# EAGLE design zzh-debug (EAGLE 9.5.2)
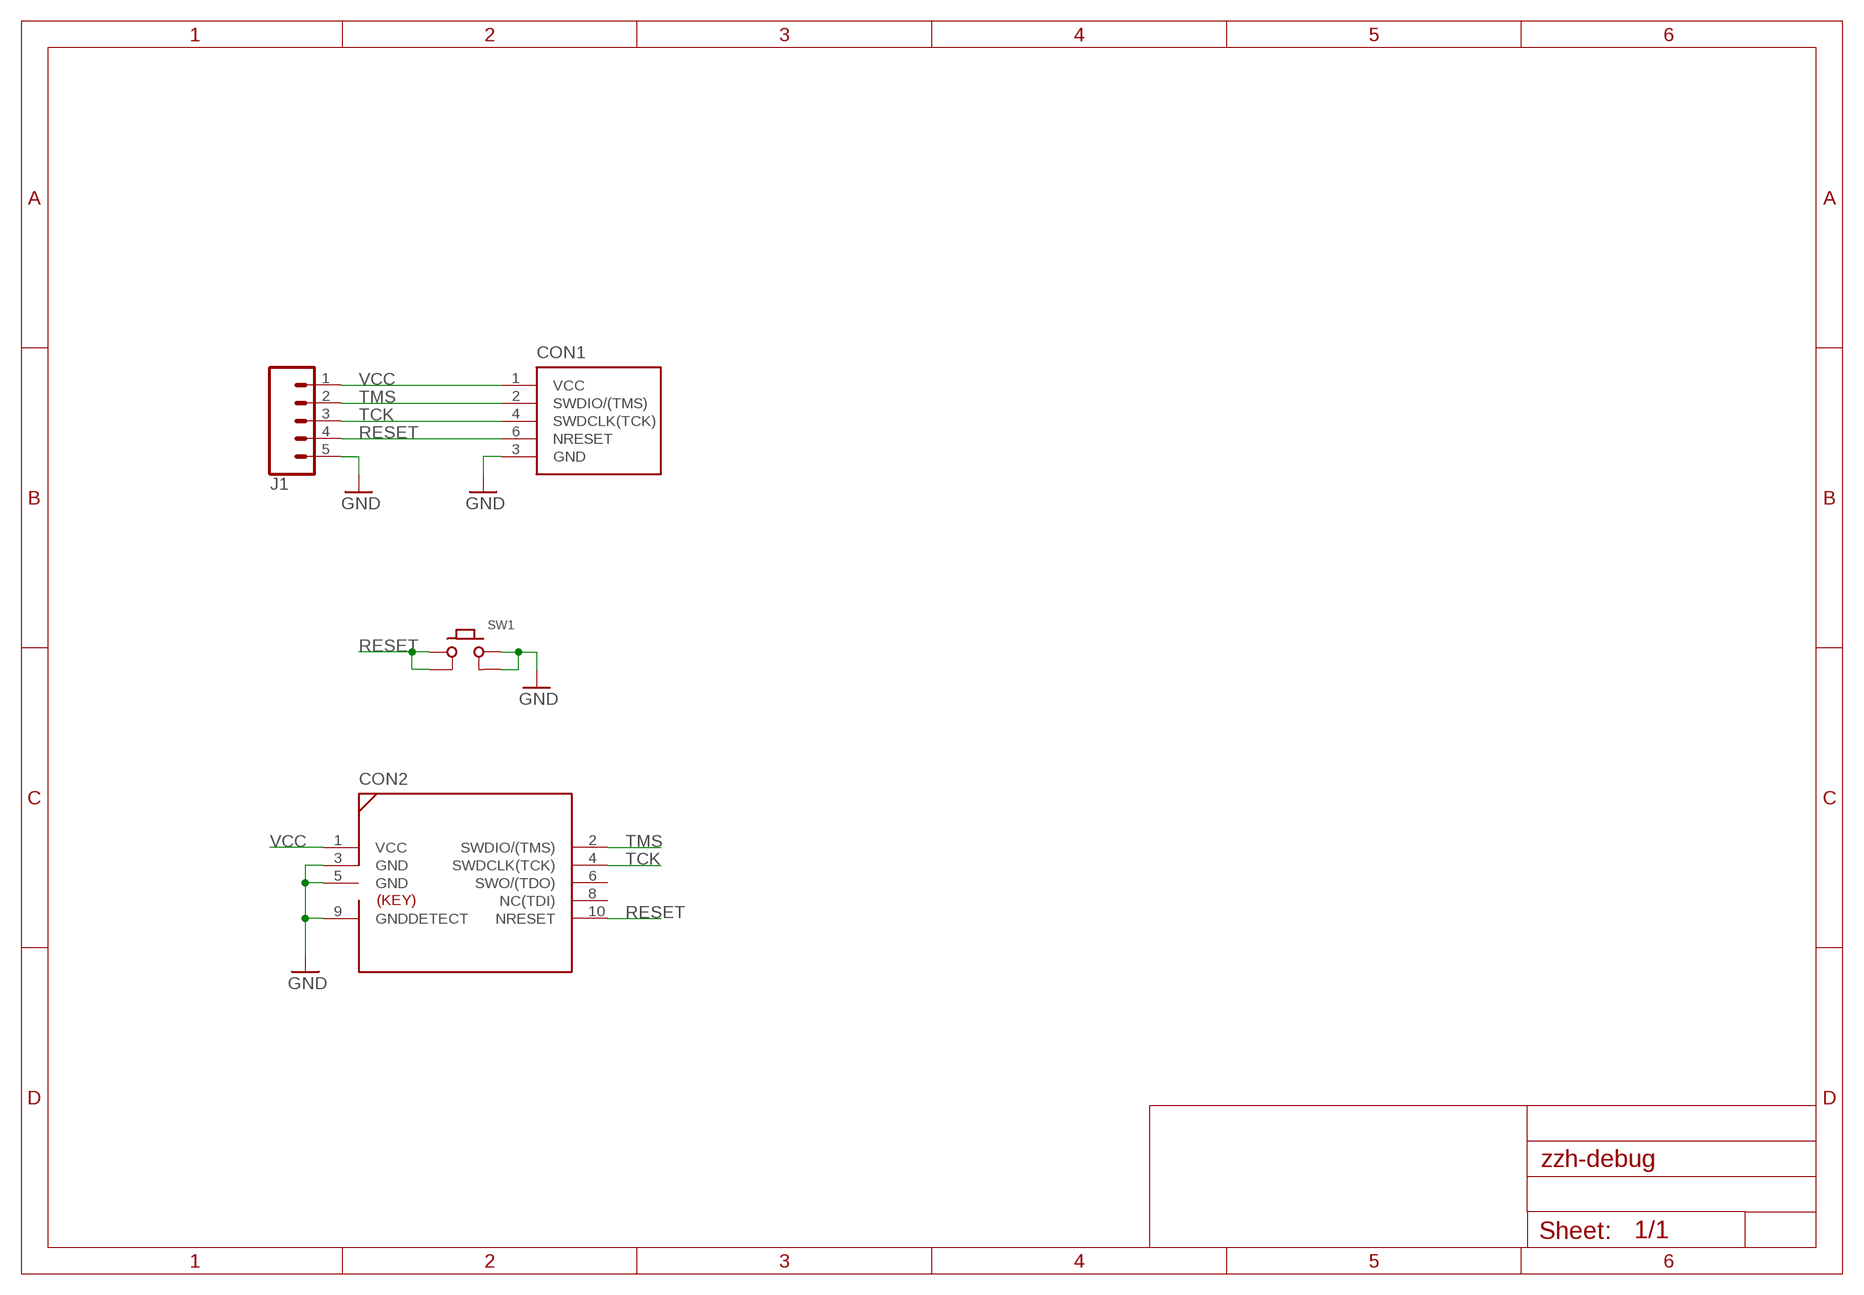
[diagram p0: schematic, sheet 1]

## Parts
CON1  DEBUG_CORTEX-SWD-5PIN-FEMALE6  [SHENZHEN_2X3_1.27MM_TH_FEMALE]
CON2  DEBUG_CORTEX-SWD-TH  [SHENZHEN_2X5_1.27MM_TH_MALE_SHROUD]
J1  CONN_05LOCK_LONGPADS  [1X05_LOCK_LONGPADS]
SW1  PUSHBUTTON-K2-1177SW-D4DW-06  [K2-1177SW-D4DW-06]

## Nets
GND: CON1.3(GND) CON2.3(GND) CON2.5(GND) CON2.9(GNDDETECT) J1.5 SW1.3(2_1) SW1.4(2_2)
RESET: CON1.6(NRESET) CON2.10(NRESET) J1.4 SW1.1(1_1) SW1.2(1_2)
TCK: CON1.4(SWDCLK(TCK)) CON2.4(SWDCLK(TCK)) J1.3
TMS: CON1.2(SWDIO/(TMS)) CON2.2(SWDIO/(TMS)) J1.2
VCC: CON1.1(VCC) CON2.1(VCC) J1.1
Unconnected: CON2.6(SWO/(TDO)) CON2.8(NC(TDI))

## Library data of the parts
CON1 = ok-testdebug-dev:DEBUG_CORTEX-SWD-5PIN
CON2 = ok-testdebug-dev:DEBUG_CORTEX-SWD
J1 = SparkFun-Connectors:CONN_05: Multi connection point. Often used as Generic Header-pin footprint for 0.1 inch spaced/style header connections On any of the 0.1 inch spaced packages, you can populate with these: Break Away Headers - Straight <https://www.sparkfun.com/products/116> (PRT-00116) Break Away Male Headers - Right Angle <https://www.sparkfun.com/products/553> (PRT-00553) Female Headers <https://www.sparkfun.com/products/115> (PRT-00115) Break Away Headers - Machine Pin <https://www.sparkfun.com/products/117> (PRT-00117) Break Away Female Headers - Swiss Machine Pin <https://www.sparkfun.com/products/743> (PRT-00743) For SCREWTERMINALS and SPRING TERMINALS visit here: Screw Terimnals on SparkFun.com <https://www.sparkfun.com/search/results?term=Screw+Terminals> (5mm/3.5mm/2.54mm spacing) This device is also useful as a general connection point to wire up your design to another part of your project. Our various solder wires solder well into these plated through hole pads. Hook-Up Wire - Assortment (Stranded, 22 AWG) <https://www.sparkfun.com/products/11375> (PRT-11375) Hook-Up Wire - Assortment (Solid Core, 22 AWG) <https://www.sparkfun.com/products/11367> (PRT-11367) View the entire wire category on our website here <https://www.sparkfun.com/categories/141> Special notes: Molex polarized connector foot print use with SKU : PRT-08231 with associated crimp pins and housings. 1MM SMD Version SKU: PRT-10208
SW1 = ok-electromech-dev:PUSHBUTTON-K2-1177SW-D4DW-06

## Board
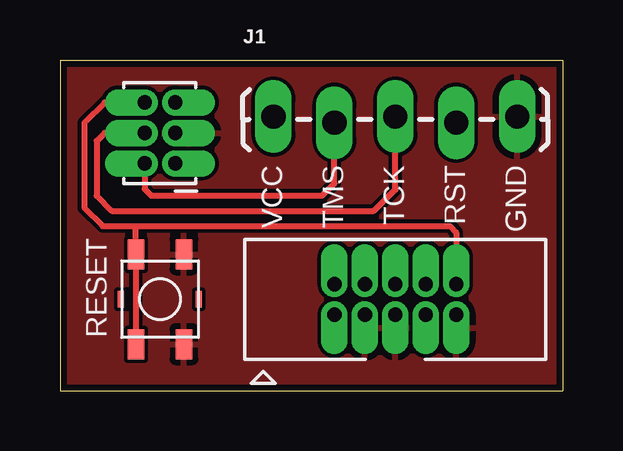
[diagram p1: board, top side]
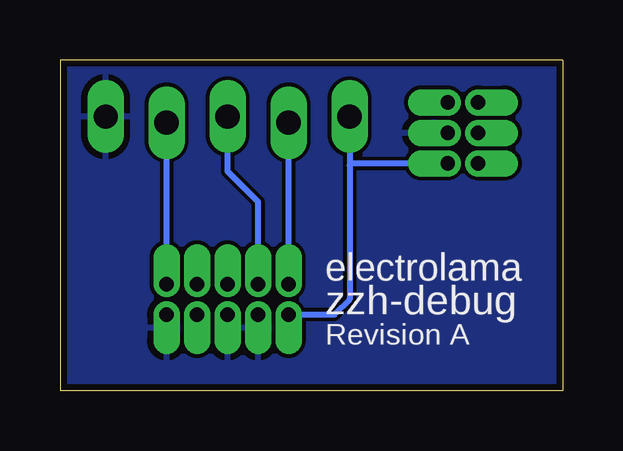
[diagram p2: board, bottom side, seen from below]

Size 20.95 x 13.79 mm. Coordinates in mm from the lower left corner, seen from the top.
Outline: 0,13.79 20.95,13.79 20.95,0 0,0 0,13.79
Copper layers (1*16): Top 0.035mm / dielectric 1.5mm / Bottom 0.035mm
Design rules "dirt_cheap_dirty_boards.v1.1": minimum track width 6mil, minimum drill 12mil, track to track 6mil, track to pad 6mil, pad to pad 6mil, via to via 6mil, smd to smd 0mil, copper to edge 10mil, drill to drill 10mil, minimum pad ring 10mil, minimum via ring 6mil, stop-mask expansion 2mil, vias tented up to drill 25mil, thermal gap 10mil

### Footprints (pad centres in the part's own frame; a part is rotated, then mirrored left to right if it is on the bottom)
SHENZHEN_2X3_1.27MM_TH_FEMALE = drill 0.6 offset: 1 -1.27,-0.635; 2 -1.27,0.635; 3 0,-0.635; 4 0,0.635; 5 1.27,-0.635; 6 1.27,0.635
SHENZHEN_2X5_1.27MM_TH_MALE_SHROUD = drill 0.6 offset: 1 -2.54,-0.635; 2 -2.54,0.635; 3 -1.27,-0.635; 4 -1.27,0.635; 5 0,-0.635; 6 0,0.635; 7 1.27,-0.635; 8 1.27,0.635; 9 2.54,-0.635; 10 2.54,0.635
1X05_LOCK_LONGPADS = drill 1.016 long: 1 0,0; 2 2.54,-0.254; 3 5.08,0; 4 7.62,-0.254; 5 10.16,0
K2-1177SW-D4DW-06 = smd 1.25 x 0.7: 1 -1.875,1; 2 1.875,1; 3 -1.875,-1; 4 1.875,-1 | smd 0.7 x 0.25: M1 0,1.625; M2 0,-1.625

### Placement (x,y rotation side)
CON1  4.17,10.74 90 top
CON2  13.97,3.81 0 top
J1  8.89,11.43 0 top
SW1  4.17,3.81 90 top

### Tracks (layer width: path | path; a pad name or v marks a point on that pad's centre or on a via)
GND
  pour Top: -0.51,-0.51 -0.51,14.22 21.59,14.22 21.59,-0.51
  pour Bottom: -0.51,-0.51 -0.51,14.22 21.59,14.22 21.59,-0.51
RESET
  Top 0.254: CON1.6 1.85,12.01 1.02,11.18 1.02,7.62 1.78,6.86 3.17,6.86 | CON2.10 16.51,6.6 16.26,6.86 3.17,6.86 | SW1.1 SW1.2 3.17,6.85 3.17,6.86
  Bottom 0.254: CON2.10 J1.4
TCK
  Top 0.254: CON1.4 1.85,10.74 1.52,10.41 1.52,8.13 2.16,7.49 13.08,7.49 13.97,8.38 J1.3
  Bottom 0.254: CON2.4 12.7,7.87 13.97,9.14 J1.3
TMS
  Top 0.254: CON1.2 3.53,8.41 3.81,8.13 10.92,8.13 11.43,8.64 J1.2
  Bottom 0.254: CON2.2 J1.2
VCC
  Bottom 0.254: CON2.1 9.53,3.17 8.89,3.81 8.89,9.4 | J1.1 8.89,9.4 | CON1.1 8.81,9.47 8.89,9.4

### Text on the board
tPlace: VCC | TMS | TCK | RST | GND | RESET
bPlace: electrolama | zzh-debug | Revision A